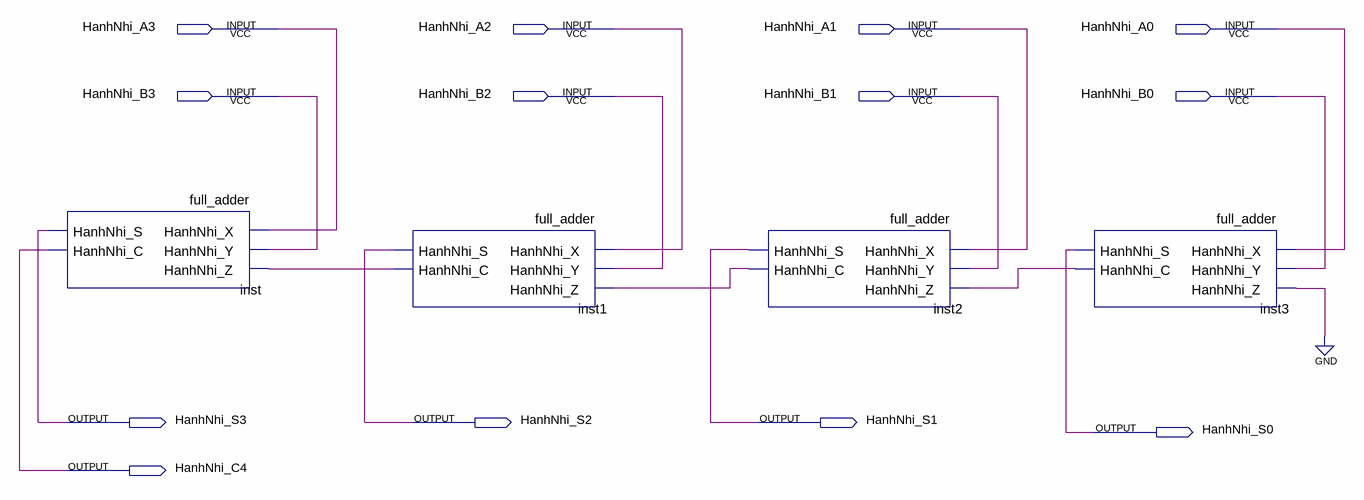
[diagram p0: schematic sheet]
// Quartus schematic ripple_carry_adder_4.bdf as structural Verilog: 4 symbols, 13 pins
module ripple_carry_adder_4 (
  input  HanhNhi_A3,
  input  HanhNhi_A2,
  input  HanhNhi_A1,
  input  HanhNhi_A0,
  input  HanhNhi_B3,
  input  HanhNhi_B2,
  input  HanhNhi_B1,
  input  HanhNhi_B0,
  output HanhNhi_S3,
  output HanhNhi_S2,
  output HanhNhi_S1,
  output HanhNhi_S0,
  output HanhNhi_C4
);

  wire inst1_hanhnhi_c, inst2_hanhnhi_c, inst3_hanhnhi_c;

  full_adder inst (
    .HanhNhi_X(HanhNhi_A3), .HanhNhi_Y(HanhNhi_B3), .HanhNhi_Z(inst1_hanhnhi_c), .HanhNhi_S(HanhNhi_S3),
    .HanhNhi_C(HanhNhi_C4));
  full_adder inst1 (
    .HanhNhi_X(HanhNhi_A2), .HanhNhi_Y(HanhNhi_B2), .HanhNhi_Z(inst2_hanhnhi_c), .HanhNhi_S(HanhNhi_S2),
    .HanhNhi_C(inst1_hanhnhi_c));
  full_adder inst2 (
    .HanhNhi_X(HanhNhi_A1), .HanhNhi_Y(HanhNhi_B1), .HanhNhi_Z(inst3_hanhnhi_c), .HanhNhi_S(HanhNhi_S1),
    .HanhNhi_C(inst2_hanhnhi_c));
  full_adder inst3 (
    .HanhNhi_X(HanhNhi_A0), .HanhNhi_Y(HanhNhi_B0), .HanhNhi_Z(1'b0), .HanhNhi_S(HanhNhi_S0),
    .HanhNhi_C(inst3_hanhnhi_c));
endmodule
